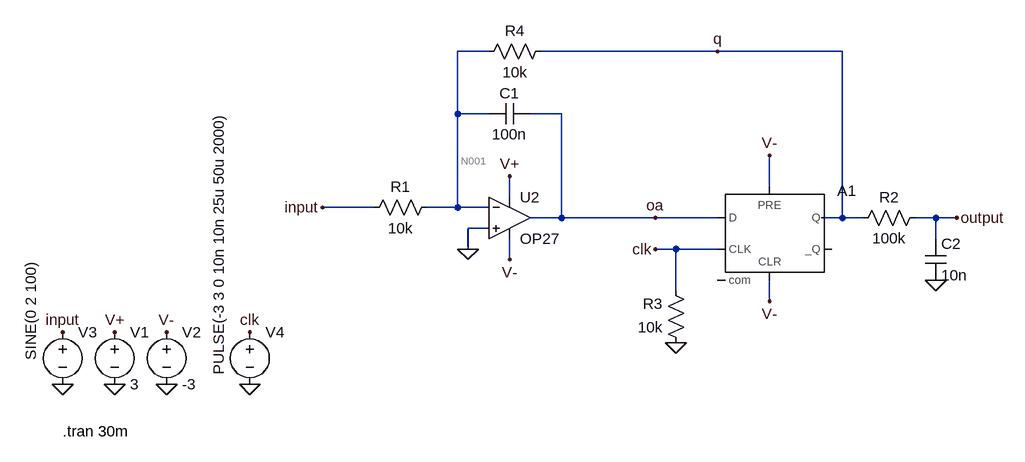
[diagram p0: schematic task1.asc]
task1.asc, the LTspice schematic file:
Version 4
SHEET 1 1920 680
WIRE 432 -640 384 -640
WIRE 784 -640 512 -640
WIRE 976 -640 784 -640
WIRE 384 -544 384 -640
WIRE 432 -544 384 -544
WIRE 544 -544 496 -544
WIRE 864 -432 864 -480
WIRE 464 -416 464 -448
WIRE 256 -400 176 -400
WIRE 384 -400 384 -544
WIRE 384 -400 336 -400
WIRE 432 -400 384 -400
WIRE 544 -384 544 -544
WIRE 544 -384 496 -384
WIRE 688 -384 544 -384
WIRE 784 -384 688 -384
WIRE 976 -384 976 -640
WIRE 976 -384 944 -384
WIRE 1008 -384 976 -384
WIRE 1120 -384 1088 -384
WIRE 1152 -384 1120 -384
WIRE 432 -368 400 -368
WIRE 1120 -352 1120 -384
WIRE 400 -336 400 -368
WIRE 720 -336 688 -336
WIRE 784 -336 720 -336
WIRE 464 -320 464 -352
WIRE 720 -272 720 -336
WIRE 864 -256 864 -288
FLAG -224 -208 input
FLAG -64 -128 0
FLAG -144 -128 0
FLAG -224 -128 0
FLAG -144 -208 V+
FLAG -64 -208 V-
FLAG 176 -400 input
FLAG 464 -448 V+
FLAG 464 -320 V-
FLAG 400 -336 0
FLAG 1152 -384 output
FLAG 64 -128 0
FLAG 64 -208 clk
FLAG 784 -640 q
FLAG 688 -384 oa
FLAG 688 -336 clk
FLAG 720 -192 0
FLAG 864 -480 V-
FLAG 864 -256 V-
FLAG 1120 -288 0
SYMBOL voltage -144 -224 R0
WINDOW 123 0 0 Left 0
WINDOW 39 0 0 Left 0
SYMATTR InstName V1
SYMATTR Value 3
SYMBOL voltage -64 -224 R0
WINDOW 123 0 0 Left 0
WINDOW 39 0 0 Left 0
SYMATTR InstName V2
SYMATTR Value -3
SYMBOL voltage -224 -224 R0
WINDOW 3 -49 -93 VRight 2
WINDOW 123 0 0 Left 0
WINDOW 39 0 0 Left 0
SYMATTR Value SINE(0 2 100)
SYMATTR InstName V3
SYMBOL OpAmps\\OP27 464 -448 R0
SYMATTR InstName U2
SYMBOL voltage 64 -224 R0
WINDOW 3 -48 -325 VRight 2
WINDOW 123 0 0 Left 0
WINDOW 39 0 0 Left 0
SYMATTR InstName V4
SYMATTR Value PULSE(-3 3 0 10n 10n 25u 50u 2000)
SYMBOL res 352 -416 R90
WINDOW 0 0 56 VBottom 2
WINDOW 3 32 56 VTop 2
SYMATTR InstName R1
SYMATTR Value 10k
SYMBOL res 1104 -400 R90
WINDOW 0 0 56 VBottom 2
WINDOW 3 32 56 VTop 2
SYMATTR InstName R2
SYMATTR Value 100k
SYMBOL res 736 -176 R180
WINDOW 0 36 76 Left 2
WINDOW 3 36 40 Left 2
SYMATTR InstName R3
SYMATTR Value 10k
SYMBOL Digital\\dflop 864 -432 R0
SYMATTR InstName A1
SYMATTR SpiceLine Vhigh=3 Vlow=-3 Trise=10n Tfall=10n
SYMBOL res 528 -656 R90
WINDOW 0 0 56 VBottom 2
WINDOW 3 32 56 VTop 2
SYMATTR InstName R4
SYMATTR Value 10k
SYMBOL cap 496 -560 R90
WINDOW 0 0 32 VBottom 2
WINDOW 3 32 32 VTop 2
SYMATTR InstName C1
SYMATTR Value 100n
SYMBOL cap 1104 -352 R0
SYMATTR InstName C2
SYMATTR Value 10n
TEXT -224 -56 Left 2 !.tran 30m

The netlist it stands for:
* task1.asc
V1 V+ 0 3
V2 V- 0 -3
V3 input 0 SINE(0 2 100)
XU2 0 N001 V+ V- oa OP27  ; pins In+ In- V+ V- OUT
V4 clk 0 PULSE(-3 3 0 10n 10n 25u 50u 2000)
R1 N001 input 10k
R2 output q 100k
R3 0 clk 10k
A1 oa 0 clk V- V- 0 q 0 DFLOP Vhigh=3 Vlow=-3 Trise=10n Tfall=10n
R4 q N001 10k
C1 oa N001 100n
C2 output 0 10n
.tran 30m
.lib ADI.lib
.backanno
.end

* Results of the author's LTspice run, read from the files saved beside the schematic
* Operating Point, zero values left out:
*   V(v+) = 3 V
*   V(v-) = -3 V
*   V(n001) = -655.8 mV
*   V(oa) = 2.145 V
*   V(clk) = -3 V
*   V(output) = -3 V
*   V(q) = -3 V
*   I(R4) = -234.4 µA
*   I(R3) = 300 µA
*   I(R1) = -65.58 µA
*   I(V4) = 300 µA
*   I(V3) = -65.58 µA
*   I(V2) = 2.369 mA
*   I(V1) = -2.361 mA
*   I8(A1) = -234.4 µA
*   I7(A1) = 234.4 µA
*   Ix(u2:1) = 168.8 µA
*   Ix(u2:2) = -168.8 µA
*   Ix(u2:3) = 2.361 mA
*   Ix(u2:4) = -2.369 mA
*   Ix(u2:5) = -4.291 pA
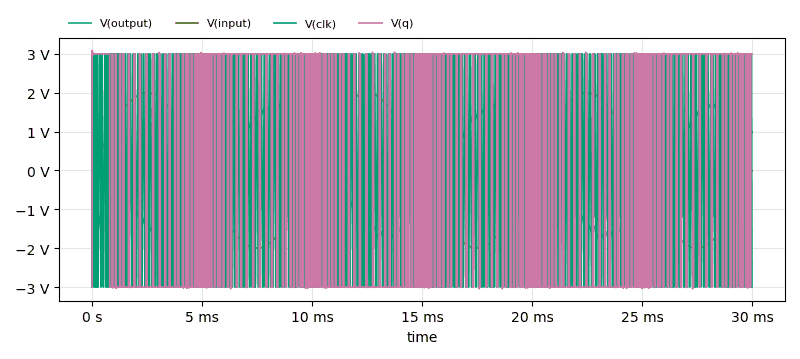
[diagram p1: Transient Analysis of task1.asc, plotted from the saved traces]
* Transient Analysis, 1 run:
*   V(output): min -3 V, max 1.826 V, average -43.15 mV, rms 1.218 V, last 994.2 mV
*   V(input): min -2 V, max 2 V, average 0 V, rms 1.414 V, last 0 V
*   V(clk): min -3 V, max 3 V, average 1.2 mV, rms 3 V, last -3 V
*   V(q): min -3.048 V, max 3.091 V, average 90 mV, rms 3 V, last 3 V